# EAGLE design corona-halo (EAGLE 9.1.3)
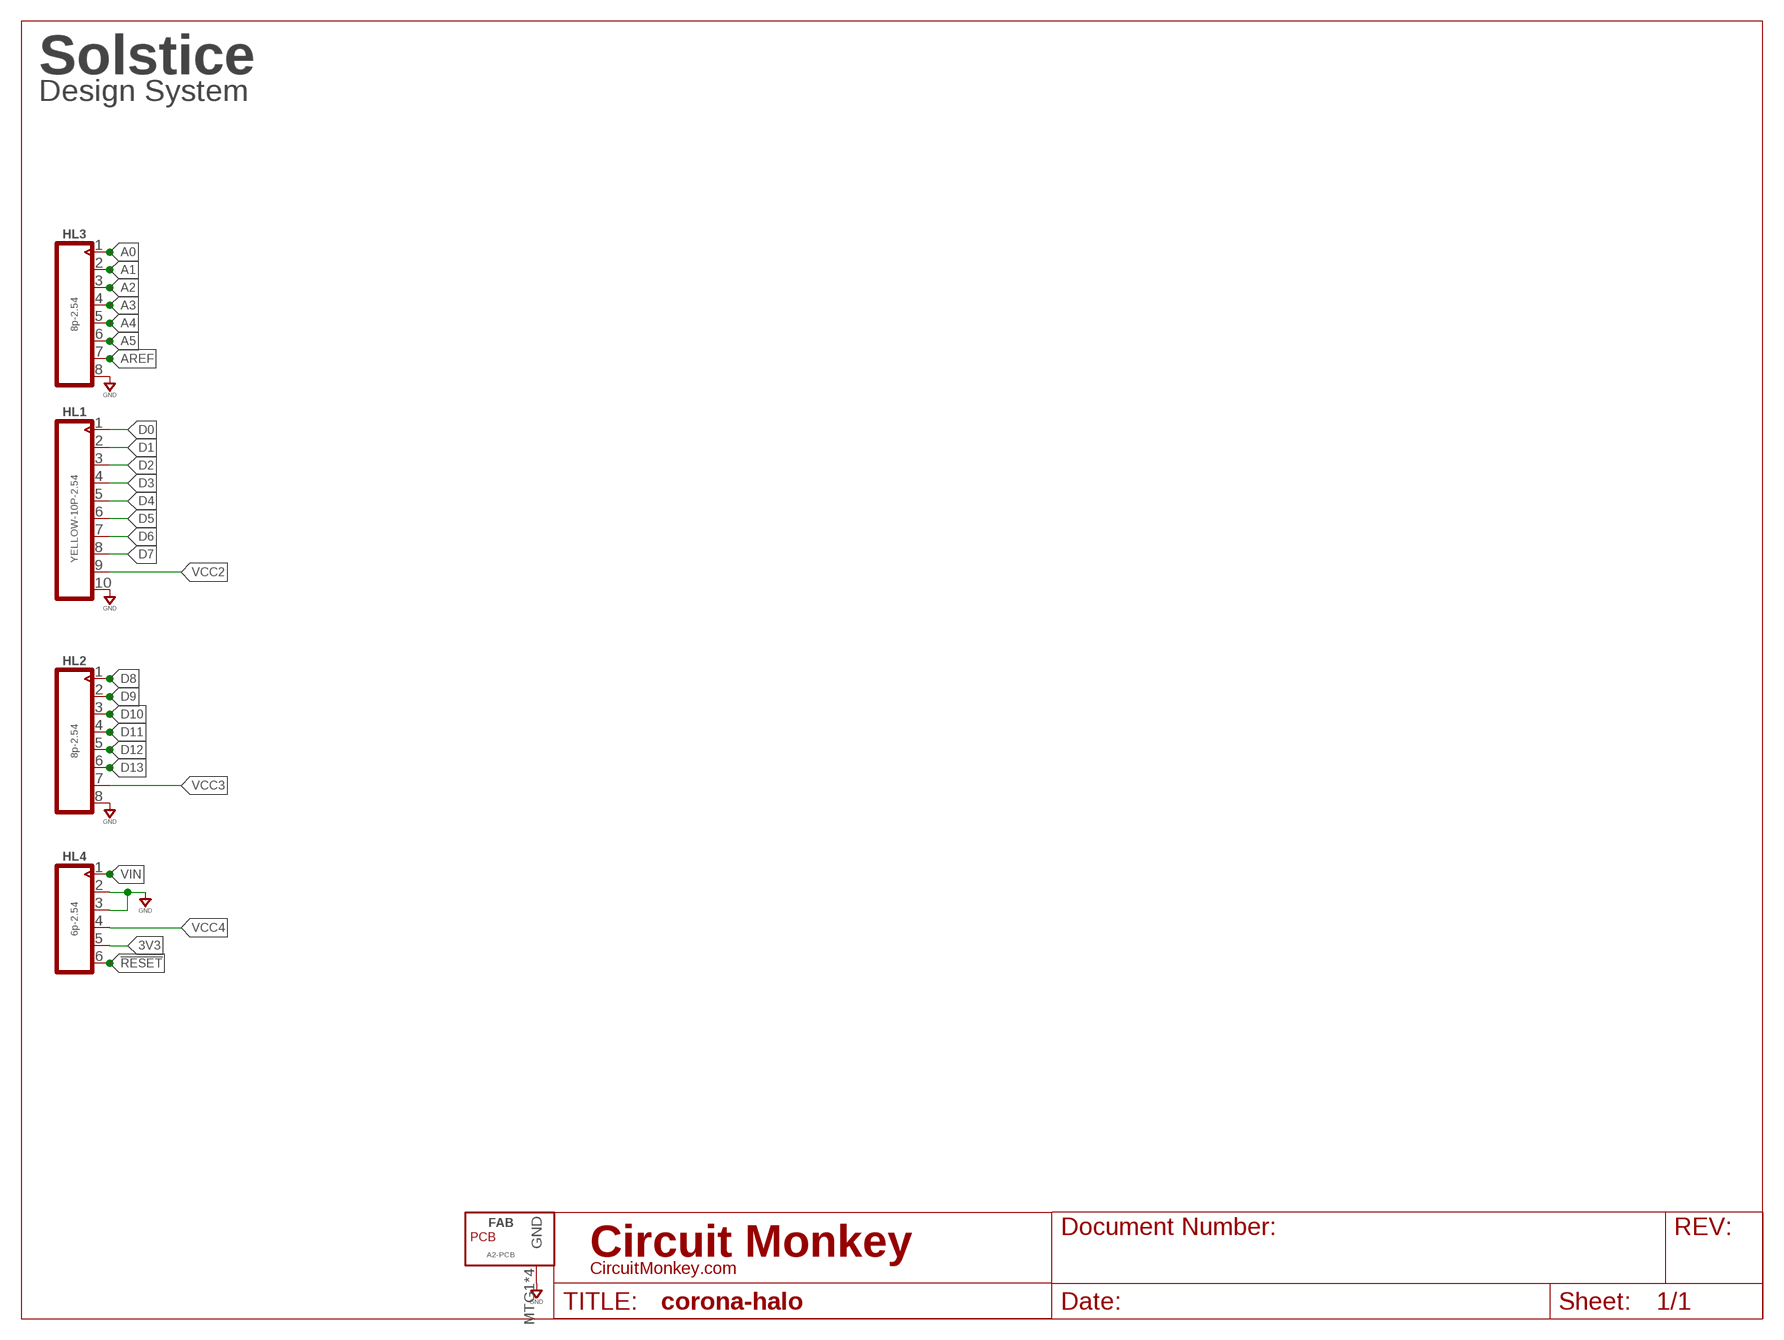
[diagram p0: schematic, sheet 1]
U$1 (LETTER_L-CIRCUITMONKEY): DOCUMENT_NUMBER: 0741-Corona; REV: A

## Parts
FAB  A2-PCB  PCB-4-MTG-HALO-A2  [PCB-HALO-A2]
HL1  YELLOW-10P-2.54  DIP-YELLOW-FEMALE-HEADER-VERT(10P-2.54)  [H10-2.54]
HL2  8p-2.54  DIP-BLACK-FEMALE-HEADER-VERT(8P-2.54)  [H8-2.54]
HL3  8p-2.54  DIP-BLACK-FEMALE-HEADER-VERT(8P-2.54)  [H8-2.54]
HL4  6p-2.54  DIP-BLACK-FEMALE-HEADER-VERT(6P-2.54)  [H6-2.54]

## Nets
3V3: HL4.5
!RESET: HL4.6
A0: HL3.1
A1: HL3.2
A2: HL3.3
A3: HL3.4
A4: HL3.5
A5: HL3.6
AREF: HL3.7
D0: HL1.1
D1: HL1.2
D2: HL1.3
D3: HL1.4
D4: HL1.5
D5: HL1.6
D6: HL1.7
D7: HL1.8
D8: HL2.1
D9: HL2.2
D10: HL2.3
D11: HL2.4
D12: HL2.5
D13: HL2.6
GND: FAB.MTG1(GND) FAB.MTG2(GND) FAB.MTG3(GND) FAB.MTG4(GND) HL1.10 HL2.8 HL3.8 HL4.2 HL4.3
VCC2: HL1.9
VCC3: HL2.7
VCC4: HL4.4
VIN: HL4.1

## Notes on the sheet
- Solstice
- Design System

## Library data of the parts
FAB = solstice-design-system:PCB-4-MTG: PCBs with 4 mounting holes
HL1 = Seeed-Connector:DIP-YELLOW-FEMALE-HEADER-VERT(10P-2.54): 320030059; MPN: F185-1110A1BSYC1
HL2 HL3 = Seeed-Connector:DIP-BLACK-FEMALE-HEADER-VERT(8P-2.54): 320030061; MPN: F185-1108A1BSYC1
HL4 = Seeed-Connector:DIP-BLACK-FEMALE-HEADER-VERT(6P-2.54): 320030060; MPN: F185-1106A1BSYC1

## Board
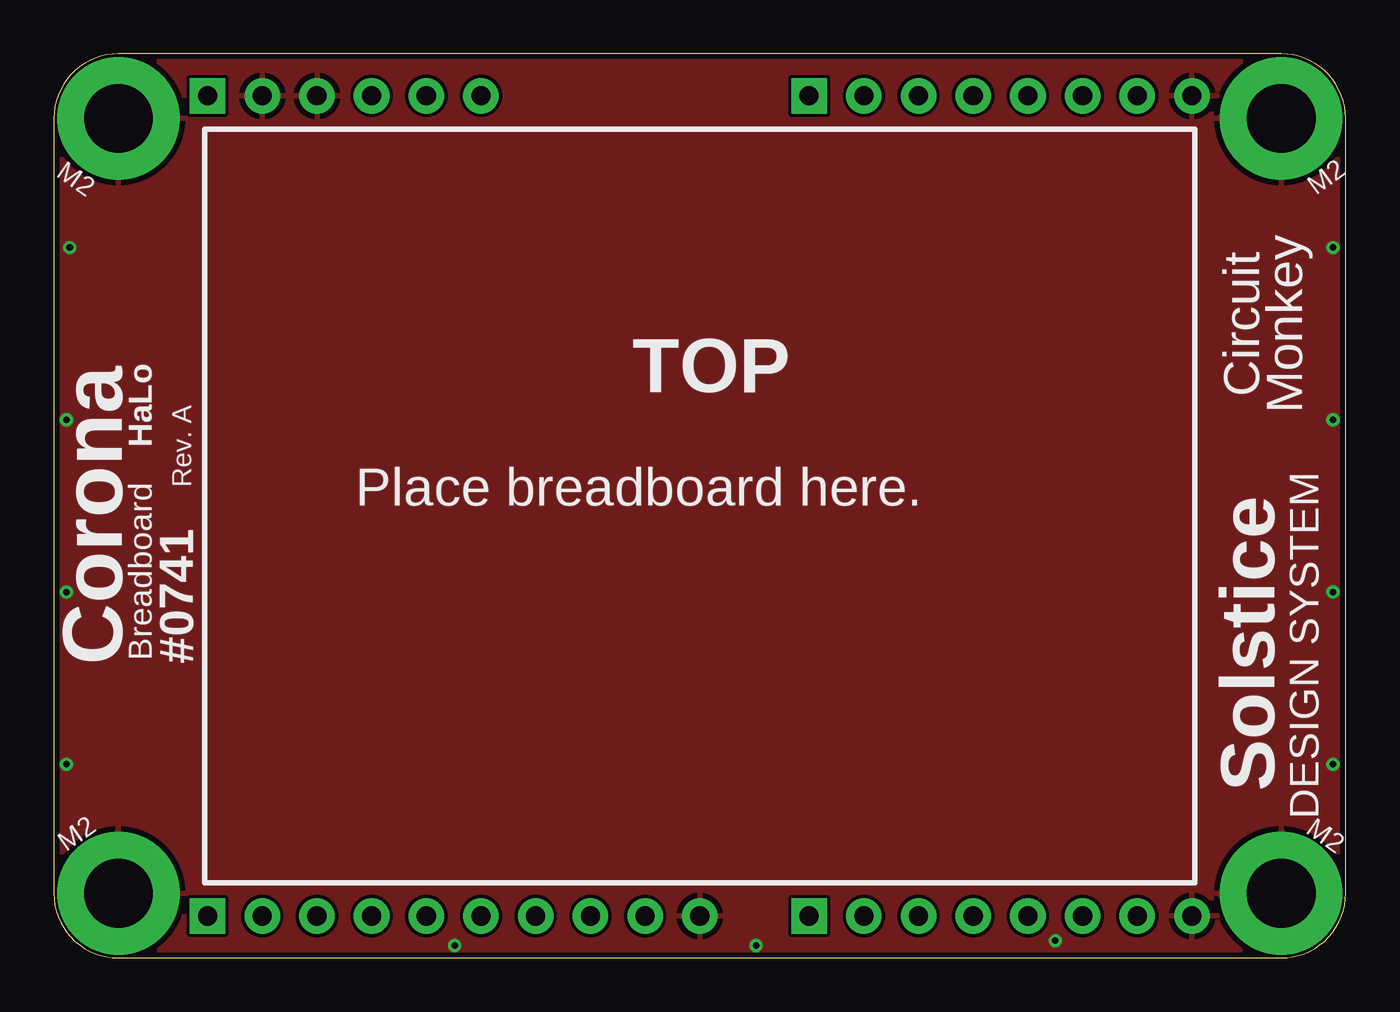
[diagram p1: board, top side]
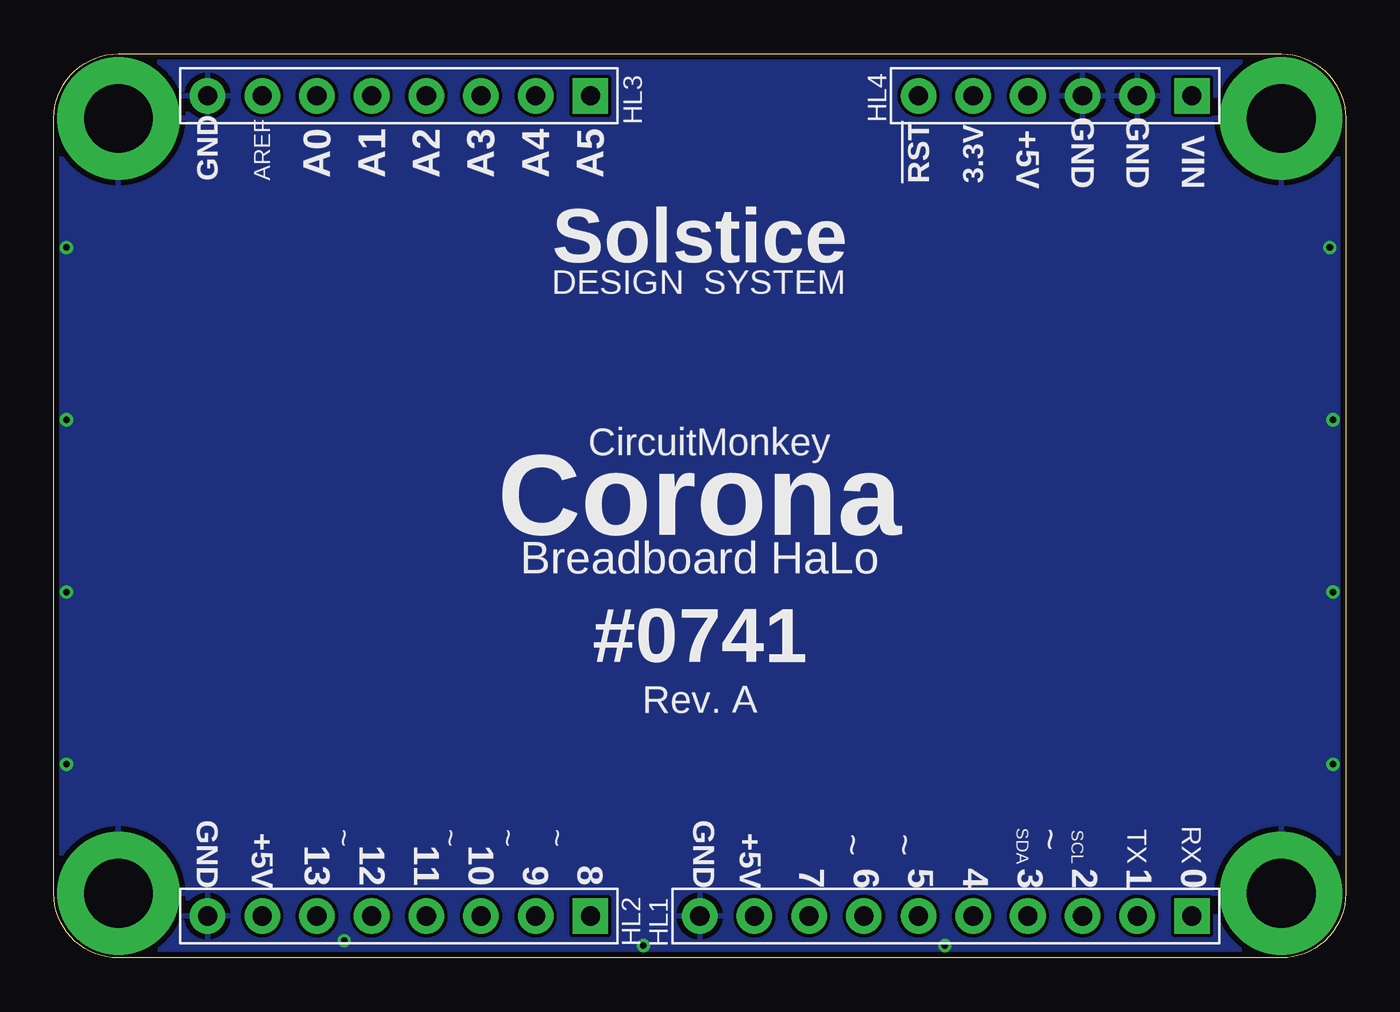
[diagram p2: board, bottom side, seen from below]

Size 60 x 42 mm. Coordinates in mm from the lower left corner, seen from the top.
Copper layers (1*16): Top 0.035mm / dielectric 1.5mm / Bottom 0.035mm
Design rules "SeeedStudio_2layer_20140221": minimum track width 6mil, minimum drill 12mil, track to track 6mil, track to pad 6mil, pad to pad 6mil, via to via 6mil, smd to smd 0mil, copper to edge 10mil, drill to drill 10mil, minimum pad ring 10mil, minimum via ring 6mil, stop-mask expansion 2mil, vias tented up to drill 100mil, thermal gap 10mil

### Footprints (pad centres in the part's own frame; a part is rotated, then mirrored left to right if it is on the bottom)
PCB-HALO-A2 = drill 3.2 pad 5.7: MTG1 -27,-18; MTG2 -27,18; MTG3 27,18; MTG4 27,-18
H10-2.54 = drill 0.889 pad 1.651 square: 1 0,11.43 | drill 0.889 pad 1.651: 2 0,8.89; 3 0,6.35; 4 0,3.81; 5 0,1.27; 6 0,-1.27; 7 0,-3.81; 8 0,-6.35; 9 0,-8.89; 10 0,-11.43
H8-2.54 = drill 0.889 pad 1.651 square: 1 0,8.89 | drill 0.889 pad 1.651: 2 0,6.35; 3 0,3.81; 4 0,1.27; 5 0,-1.27; 6 0,-3.81; 7 0,-6.35; 8 0,-8.89
H6-2.54 = drill 0.889 pad 1.651 square: 1 0,6.35 | drill 0.889 pad 1.651: 2 0,3.81; 3 0,1.27; 4 0,-1.27; 5 0,-3.81; 6 0,-6.35

### Placement (x,y rotation side)
FAB  30,21 0 top
HL1  18.57,1.95 270 bottom
HL2  43.97,1.95 270 bottom
HL3  43.97,40.05 270 bottom
HL4  13.49,40.05 270 bottom

### Tracks (layer width: path | path; a pad name or v marks a point on that pad's centre or on a via)
GND  (via drill 0.3)
  other vias: 18.62,0.58 0.59,9 0.59,17 0.59,25 0.74,33 32.62,0.58 46.51,0.81 59.41,25 59.41,17 59.41,33 59.41,9
  pour Top (rank 5): 0,0 60,0 60,42 0,42
  pour Bottom (rank 5): 0,0 60,0 60,42 0,42

### Text on the board
tPlace: Circuit / Monkey | TOP | HaLo | Rev. A | Corona | Place breadboard here. | Breadboard | #0741 | Solstice | DESIGN SYSTEM
bPlace: Solstice | DESIGN SYSTEM | CircuitMonkey | Corona | Breadboard HaLo | #0741 | Rev. A